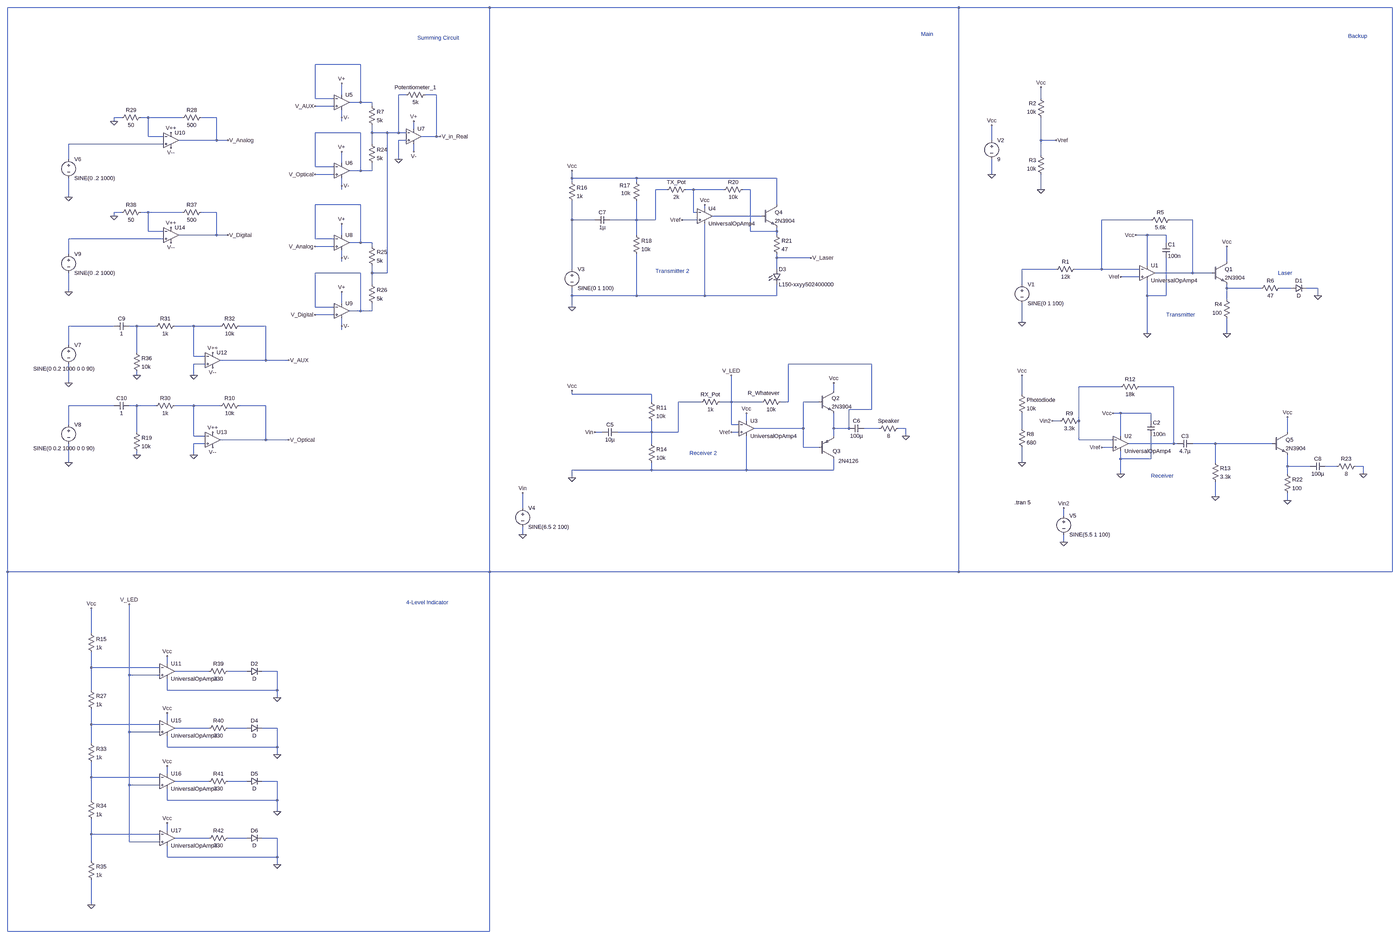
[diagram p0: schematic Draft1.asc, whole sheet]
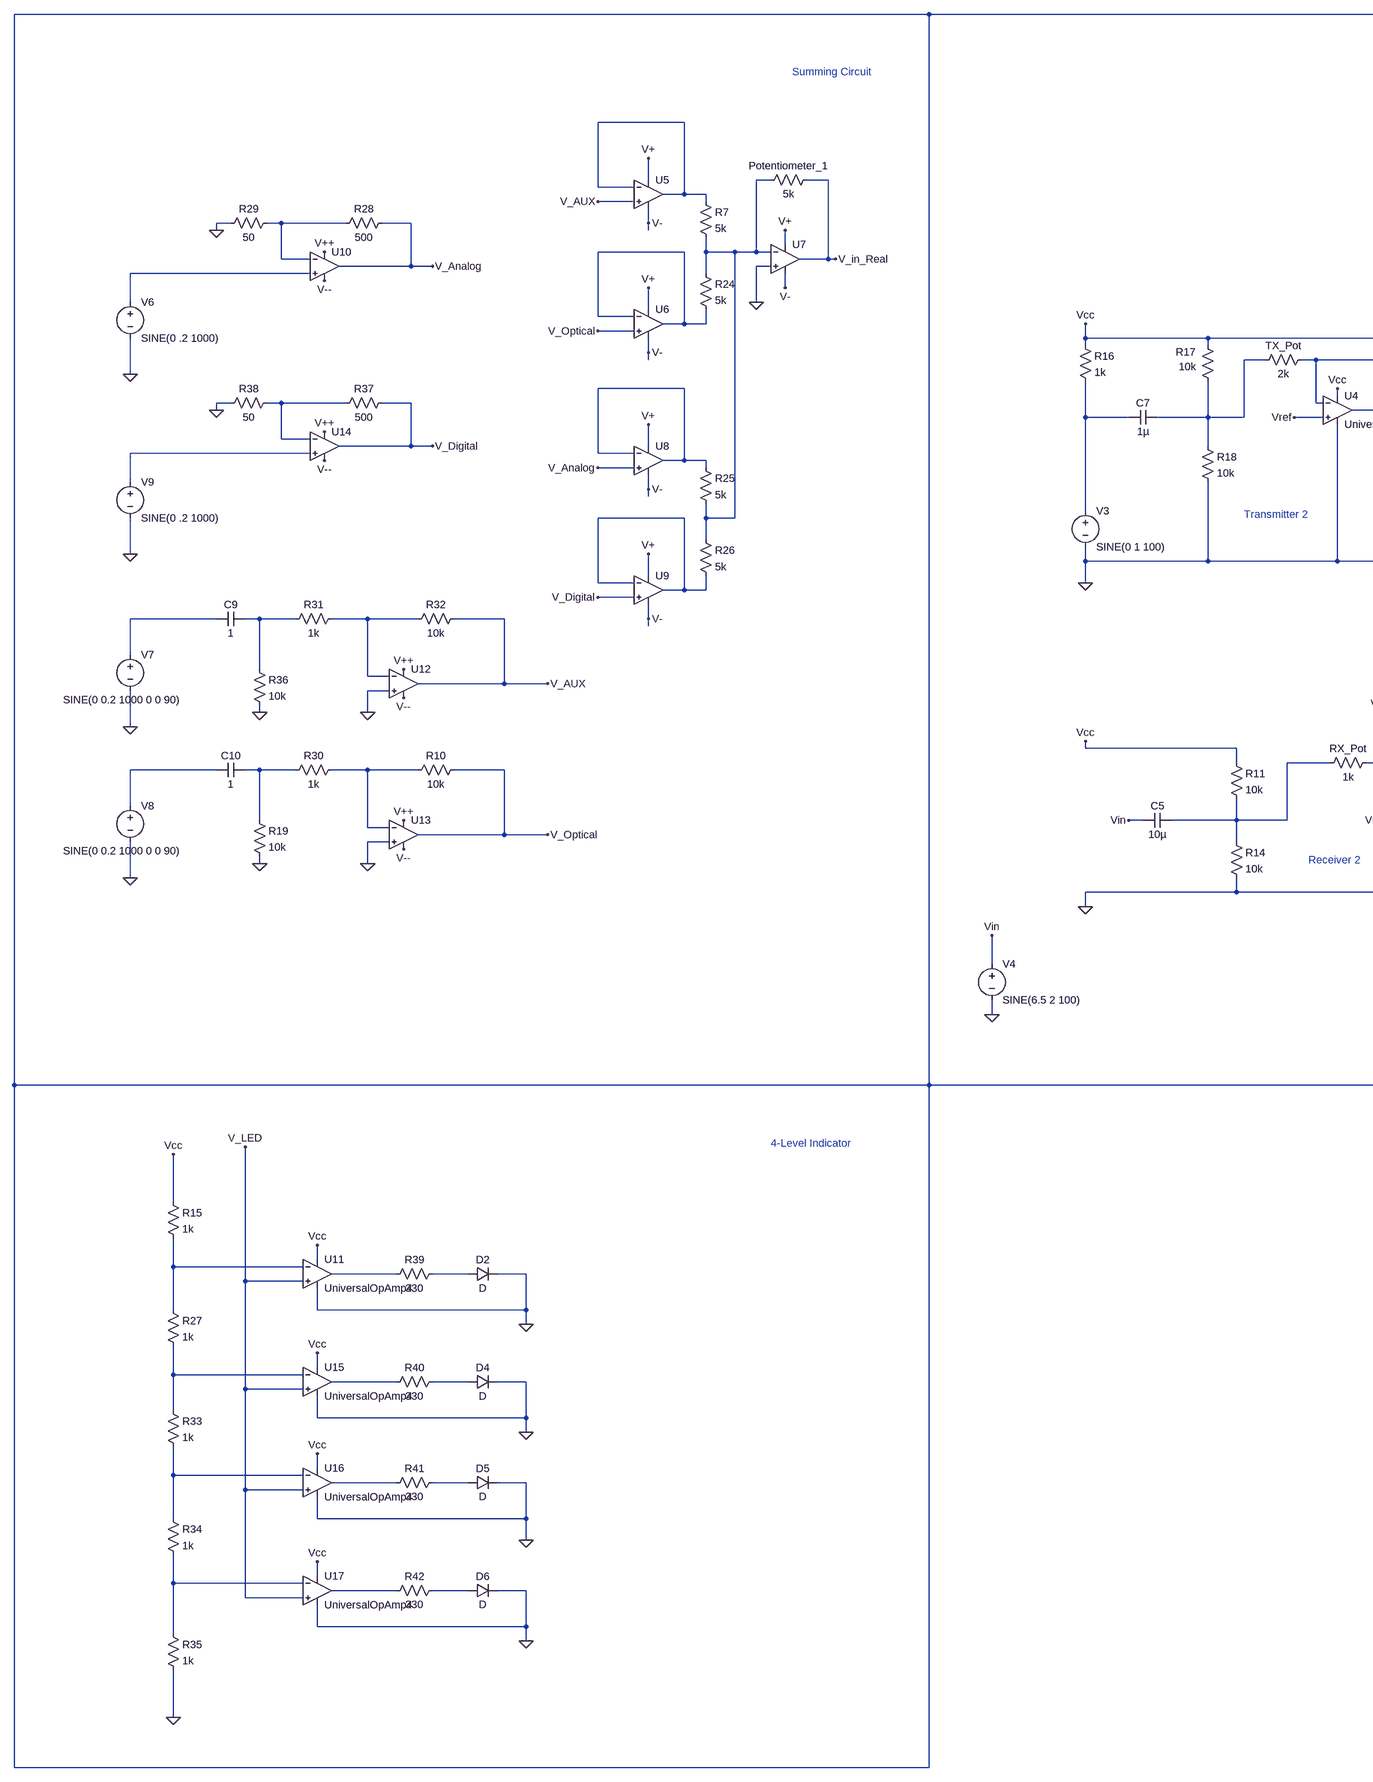
[diagram p1: schematic Draft1.asc, part, row 1 of 1, column 1 of 2]
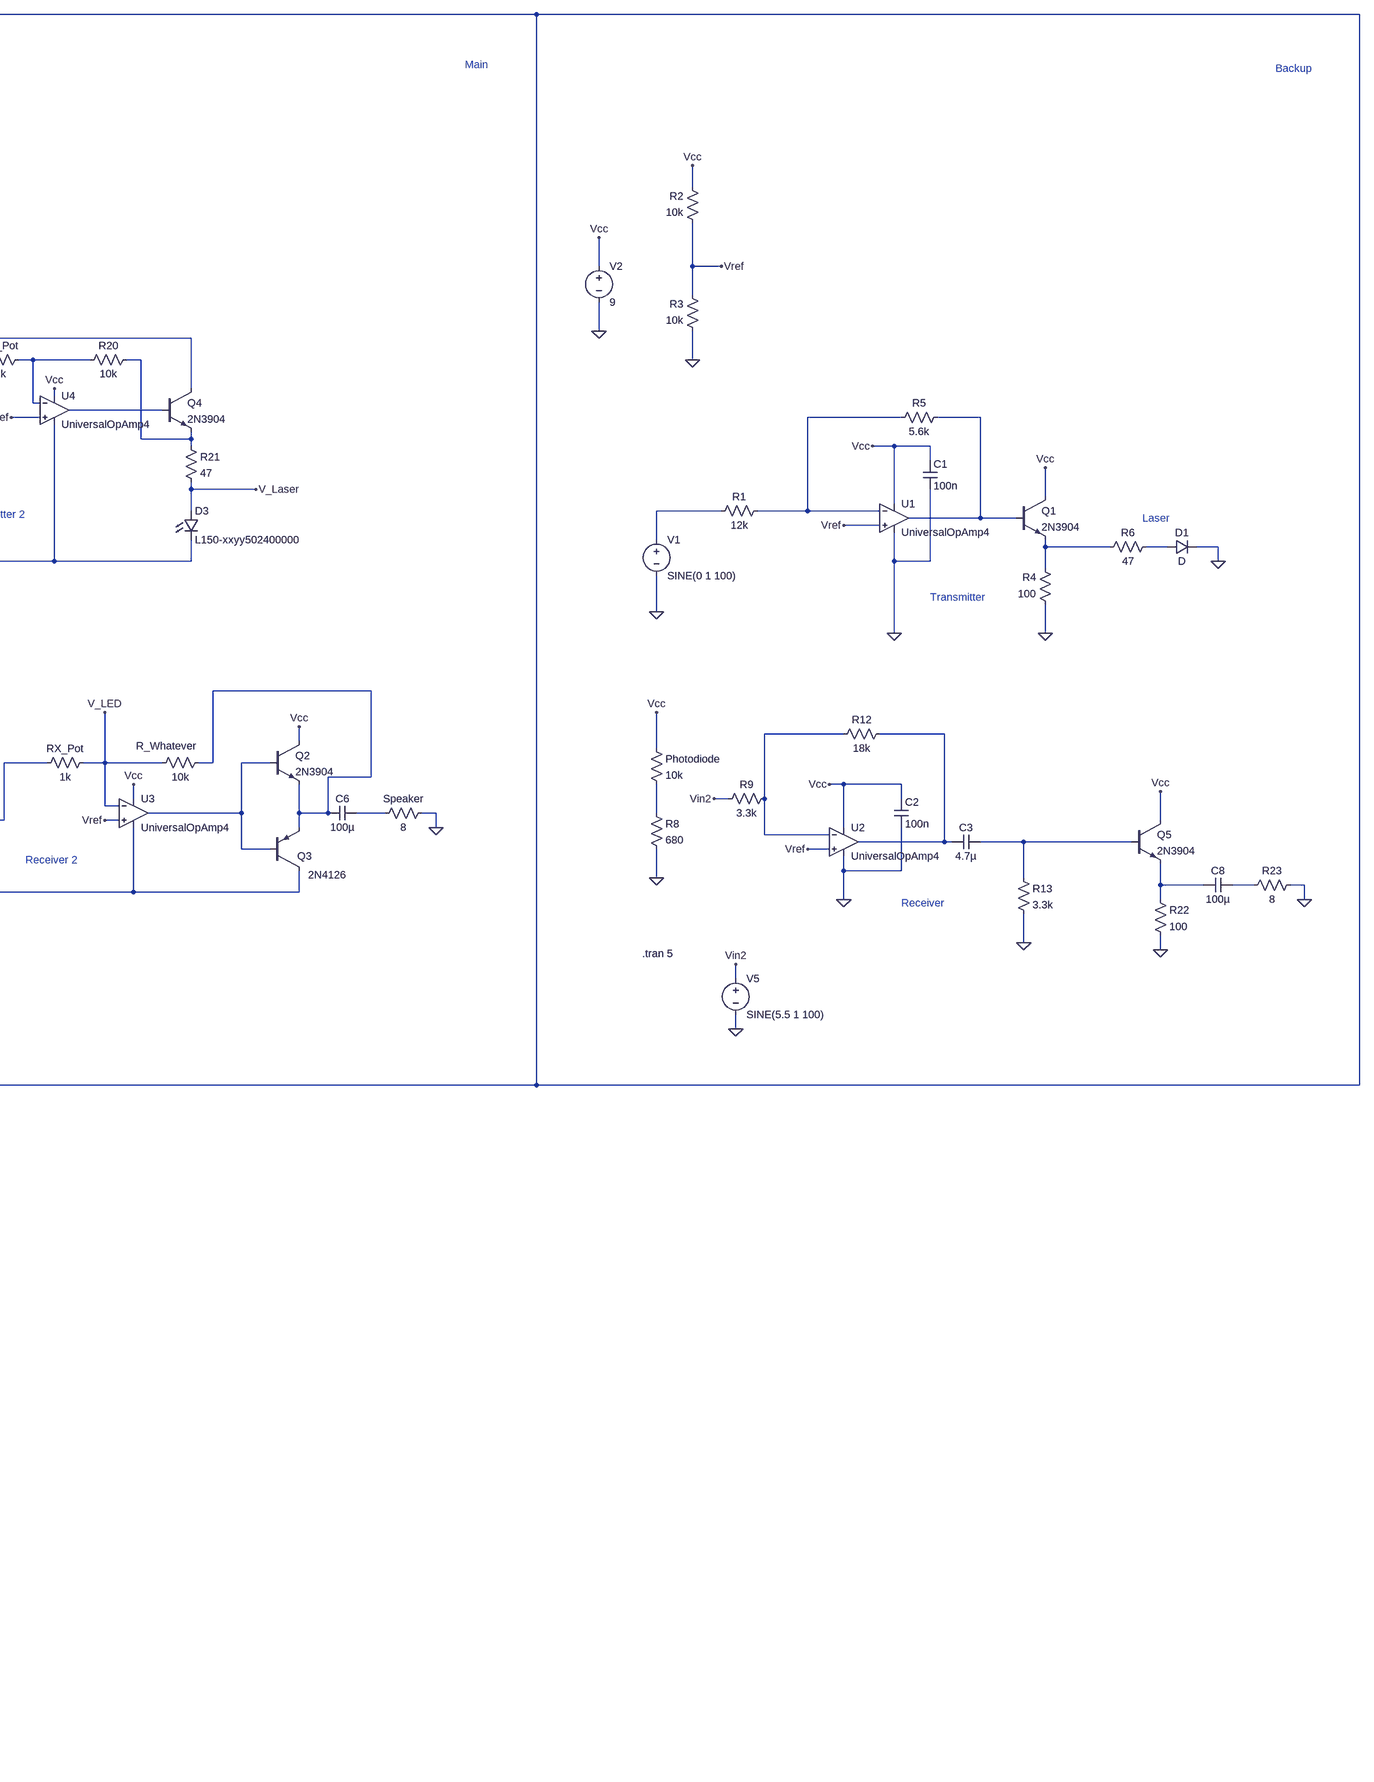
[diagram p2: schematic Draft1.asc, part, row 1 of 1, column 2 of 2]
Draft1.asc, the LTspice schematic file:
Version 4.1
SHEET 1 5492 4292
WIRE 1456 -944 -624 -944
WIRE 3520 -944 1456 -944
WIRE 5488 -944 3520 -944
WIRE 912 -704 720 -704
WIRE 832 -576 832 -624
WIRE 1104 -576 1072 -576
WIRE 1232 -576 1184 -576
WIRE 720 -560 720 -704
WIRE 800 -560 720 -560
WIRE 3952 -560 3952 -608
WIRE 912 -544 912 -704
WIRE 912 -544 864 -544
WIRE 960 -544 912 -544
WIRE 800 -528 720 -528
WIRE 960 -528 960 -544
WIRE -96 -480 -128 -480
WIRE 16 -480 -16 -480
WIRE 160 -480 16 -480
WIRE 304 -480 240 -480
WIRE 832 -480 832 -512
WIRE -128 -464 -128 -480
WIRE 832 -464 832 -480
WIRE 1136 -432 1136 -464
WIRE 912 -416 720 -416
WIRE 960 -416 960 -448
WIRE 1024 -416 960 -416
WIRE 1072 -416 1072 -576
WIRE 1072 -416 1024 -416
WIRE 1104 -416 1072 -416
WIRE 16 -400 16 -480
WIRE 80 -400 16 -400
WIRE 1232 -400 1232 -576
WIRE 1232 -400 1168 -400
WIRE 1248 -400 1232 -400
WIRE 304 -384 304 -480
WIRE 304 -384 144 -384
WIRE 352 -384 304 -384
WIRE 1104 -384 1072 -384
WIRE 3744 -384 3744 -448
WIRE 3952 -384 3952 -480
WIRE 4016 -384 3952 -384
WIRE 80 -368 -320 -368
WIRE 960 -368 960 -416
WIRE 1136 -336 1136 -368
WIRE 3952 -320 3952 -384
WIRE -320 -304 -320 -368
WIRE 1072 -304 1072 -384
WIRE 832 -288 832 -336
WIRE 720 -272 720 -416
WIRE 800 -272 720 -272
WIRE 912 -256 912 -416
WIRE 912 -256 864 -256
WIRE 960 -256 960 -288
WIRE 960 -256 912 -256
WIRE 800 -240 720 -240
WIRE 3744 -240 3744 -304
WIRE 1872 -224 1872 -256
WIRE 2144 -224 1872 -224
WIRE 2736 -224 2144 -224
WIRE 1872 -208 1872 -224
WIRE 2144 -208 2144 -224
WIRE 832 -192 832 -224
WIRE 832 -176 832 -192
WIRE 2272 -176 2224 -176
WIRE 2384 -176 2352 -176
WIRE 2512 -176 2384 -176
WIRE 2624 -176 2592 -176
WIRE 3952 -176 3952 -240
WIRE -320 -144 -320 -224
WIRE 912 -112 720 -112
WIRE 2736 -112 2736 -224
WIRE 2432 -96 2432 -112
WIRE -96 -80 -128 -80
WIRE 16 -80 -16 -80
WIRE 160 -80 16 -80
WIRE 304 -80 240 -80
WIRE 2384 -80 2384 -176
WIRE 2400 -80 2384 -80
WIRE -128 -64 -128 -80
WIRE 2672 -64 2464 -64
WIRE 1872 -48 1872 -128
WIRE 1968 -48 1872 -48
WIRE 2144 -48 2144 -128
WIRE 2144 -48 2032 -48
WIRE 2224 -48 2224 -176
WIRE 2224 -48 2144 -48
WIRE 2400 -48 2336 -48
WIRE 4416 -48 4208 -48
WIRE 4592 -48 4496 -48
WIRE 16 0 16 -80
WIRE 80 0 16 0
WIRE 2624 0 2624 -176
WIRE 2736 0 2736 -16
WIRE 2736 0 2624 0
WIRE 304 16 304 -80
WIRE 304 16 144 16
WIRE 352 16 304 16
WIRE 832 16 832 -32
WIRE 2144 16 2144 -48
WIRE 2736 16 2736 0
WIRE 4400 16 4352 16
WIRE 4480 16 4400 16
WIRE 80 32 -320 32
WIRE 720 32 720 -112
WIRE 800 32 720 32
WIRE 912 48 912 -112
WIRE 912 48 864 48
WIRE 960 48 912 48
WIRE 4480 48 4480 16
WIRE 800 64 720 64
WIRE 960 64 960 48
WIRE -320 96 -320 32
WIRE 832 112 832 80
WIRE 2736 112 2736 96
WIRE 2880 112 2736 112
WIRE 832 128 832 112
WIRE 4736 128 4736 64
WIRE 4400 144 4400 16
WIRE 1872 160 1872 -48
WIRE 2736 160 2736 112
WIRE 4016 160 3872 160
WIRE 4208 160 4208 -48
WIRE 4208 160 4096 160
WIRE 4368 160 4208 160
WIRE 912 176 720 176
WIRE 960 176 960 144
WIRE 1024 176 1024 -416
WIRE 1024 176 960 176
WIRE 4592 176 4592 -48
WIRE 4592 176 4432 176
WIRE 4672 176 4592 176
WIRE 4368 192 4288 192
WIRE 960 224 960 176
WIRE 3872 224 3872 160
WIRE 4736 240 4736 224
WIRE 4880 240 4736 240
WIRE 5008 240 4960 240
WIRE 5120 240 5072 240
WIRE -320 256 -320 176
WIRE 1872 272 1872 240
WIRE 2144 272 2144 96
WIRE 2144 272 1872 272
WIRE 2432 272 2432 -32
WIRE 2432 272 2144 272
WIRE 2736 272 2736 224
WIRE 2736 272 2432 272
WIRE 4400 272 4400 208
WIRE 4480 272 4480 112
WIRE 4480 272 4400 272
WIRE 5120 272 5120 240
WIRE 4736 288 4736 240
WIRE 832 304 832 256
WIRE 720 320 720 176
WIRE 800 320 720 320
WIRE 1872 320 1872 272
WIRE 912 336 912 176
WIRE 912 336 864 336
WIRE 960 336 960 304
WIRE 960 336 912 336
WIRE 800 352 720 352
WIRE 3872 384 3872 304
WIRE -128 400 -320 400
WIRE -32 400 -64 400
WIRE 48 400 -32 400
WIRE 208 400 128 400
WIRE 320 400 208 400
WIRE 512 400 400 400
WIRE 832 400 832 368
WIRE 832 416 832 400
WIRE 4400 432 4400 272
WIRE 4736 432 4736 368
WIRE -320 480 -320 400
WIRE -32 512 -32 400
WIRE 208 528 208 400
WIRE 256 528 208 528
WIRE 512 544 512 400
WIRE 512 544 320 544
WIRE 608 544 512 544
WIRE 256 560 208 560
WIRE 3136 560 2784 560
WIRE -32 608 -32 592
WIRE 208 608 208 560
WIRE -320 640 -320 560
WIRE 4288 656 4112 656
WIRE 4512 656 4368 656
WIRE 2976 672 2976 640
WIRE 1872 688 1872 672
WIRE 2208 688 1872 688
WIRE 3872 688 3872 608
WIRE 2208 720 2208 688
WIRE 2416 720 2320 720
WIRE 2544 720 2544 608
WIRE 2544 720 2496 720
WIRE 2672 720 2544 720
WIRE 2784 720 2784 560
WIRE 2784 720 2752 720
WIRE 2912 720 2848 720
WIRE -128 736 -320 736
WIRE -32 736 -64 736
WIRE 48 736 -32 736
WIRE 208 736 128 736
WIRE 320 736 208 736
WIRE 512 736 400 736
WIRE 3136 752 3136 560
WIRE 3136 752 3040 752
WIRE 4288 768 4256 768
WIRE 4416 768 4288 768
WIRE 2608 800 2608 768
WIRE 4032 800 4000 800
WIRE 4112 800 4112 656
WIRE 4416 800 4416 768
WIRE -320 816 -320 736
WIRE 2544 816 2544 720
WIRE 2576 816 2544 816
WIRE 2848 832 2848 720
WIRE 2848 832 2640 832
WIRE 2976 832 2976 768
WIRE 3040 832 3040 752
WIRE 3040 832 2976 832
WIRE 3168 832 3104 832
WIRE 3280 832 3248 832
WIRE 3872 832 3872 768
WIRE -32 848 -32 736
WIRE 2000 848 1968 848
WIRE 2208 848 2208 800
WIRE 2208 848 2064 848
WIRE 2320 848 2320 720
WIRE 2320 848 2208 848
WIRE 2576 848 2544 848
WIRE 4992 848 4992 784
WIRE 208 864 208 736
WIRE 256 864 208 864
WIRE 2976 864 2976 832
WIRE 3280 864 3280 832
WIRE 4288 864 4288 768
WIRE 512 880 512 736
WIRE 512 880 320 880
WIRE 608 880 512 880
WIRE 4112 880 4112 800
WIRE 4256 880 4112 880
WIRE 256 896 208 896
WIRE 2208 896 2208 848
WIRE 4512 896 4512 656
WIRE 4512 896 4320 896
WIRE 4528 896 4512 896
WIRE 4688 896 4592 896
WIRE 4928 896 4688 896
WIRE 2848 912 2848 832
WIRE 2912 912 2848 912
WIRE 4256 912 4208 912
WIRE -32 944 -32 928
WIRE 208 944 208 896
WIRE 4288 960 4288 928
WIRE 4416 960 4416 864
WIRE 4416 960 4288 960
WIRE -320 976 -320 896
WIRE 3872 976 3872 912
WIRE 4688 976 4688 896
WIRE 4992 992 4992 944
WIRE 5088 992 4992 992
WIRE 5200 992 5152 992
WIRE 5312 992 5280 992
WIRE 2208 1008 2208 976
WIRE 2208 1008 1872 1008
WIRE 2608 1008 2608 864
WIRE 2608 1008 2208 1008
WIRE 2976 1008 2976 960
WIRE 2976 1008 2608 1008
WIRE 4288 1024 4288 960
WIRE 4992 1024 4992 992
WIRE 5312 1024 5312 992
WIRE 1872 1040 1872 1008
WIRE 4688 1120 4688 1056
WIRE 4992 1136 4992 1104
WIRE 1664 1168 1664 1104
WIRE 4048 1200 4048 1168
WIRE 1664 1280 1664 1248
WIRE 4048 1312 4048 1280
WIRE -624 1472 -624 -944
WIRE 1456 1472 1456 -944
WIRE 1456 1472 -624 1472
WIRE 3520 1472 3520 -944
WIRE 3520 1472 1456 1472
WIRE 5488 1472 5488 -944
WIRE 5488 1472 3520 1472
WIRE -224 1760 -224 1632
WIRE 96 1888 96 1856
WIRE -224 1904 -224 1840
WIRE 64 1904 -224 1904
WIRE 272 1920 128 1920
WIRE 432 1920 352 1920
WIRE 560 1920 496 1920
WIRE -64 1936 -64 1616
WIRE 64 1936 -64 1936
WIRE -224 2000 -224 1904
WIRE 96 2000 96 1952
WIRE 560 2000 560 1920
WIRE 560 2000 96 2000
WIRE 560 2032 560 2000
WIRE 96 2128 96 2096
WIRE -224 2144 -224 2080
WIRE 64 2144 -224 2144
WIRE 272 2160 128 2160
WIRE 432 2160 352 2160
WIRE 560 2160 496 2160
WIRE -64 2176 -64 1936
WIRE 64 2176 -64 2176
WIRE -224 2224 -224 2144
WIRE 96 2240 96 2192
WIRE 560 2240 560 2160
WIRE 560 2240 96 2240
WIRE 560 2272 560 2240
WIRE 96 2352 96 2320
WIRE -224 2368 -224 2304
WIRE 64 2368 -224 2368
WIRE 272 2384 128 2384
WIRE 432 2384 352 2384
WIRE 560 2384 496 2384
WIRE -64 2400 -64 2176
WIRE 64 2400 -64 2400
WIRE -224 2464 -224 2368
WIRE 96 2464 96 2416
WIRE 560 2464 560 2384
WIRE 560 2464 96 2464
WIRE 560 2512 560 2464
WIRE 96 2592 96 2560
WIRE -224 2608 -224 2544
WIRE 64 2608 -224 2608
WIRE 272 2624 128 2624
WIRE 432 2624 352 2624
WIRE 560 2624 496 2624
WIRE -64 2640 -64 2400
WIRE 64 2640 -64 2640
WIRE 96 2704 96 2656
WIRE 560 2704 560 2624
WIRE 560 2704 96 2704
WIRE -224 2720 -224 2608
WIRE 560 2736 560 2704
WIRE -224 2976 -224 2800
WIRE -624 3088 -624 1472
WIRE 1456 3088 1456 1472
WIRE 1456 3088 -624 3088
FLAG 3872 384 0
FLAG 4400 432 0
FLAG 4736 432 0
FLAG 5120 272 0
FLAG 4736 64 Vcc
FLAG 3952 -608 Vcc
FLAG 4352 16 Vcc
FLAG 3744 -240 0
FLAG 3744 -448 Vcc
FLAG 3872 976 0
FLAG 4288 1024 0
FLAG 4688 1120 0
FLAG 3872 608 Vcc
FLAG 4256 768 Vcc
FLAG 4016 -384 Vref
FLAG 4288 192 Vref
FLAG 4208 912 Vref
FLAG 3952 -176 0
FLAG 1872 1040 0
FLAG 1872 672 Vcc
FLAG 2608 768 Vcc
FLAG 2976 640 Vcc
FLAG 3280 864 0
FLAG 1872 320 0
FLAG 1872 -256 Vcc
FLAG 2432 -112 Vcc
FLAG 2336 -48 Vref
FLAG 2544 848 Vref
FLAG 4992 784 Vcc
FLAG 4992 1136 0
FLAG 5312 1024 0
FLAG 1664 1280 0
FLAG 1664 1104 Vin
FLAG 1968 848 Vin
FLAG 4048 1168 Vin2
FLAG 4048 1312 0
FLAG 4000 800 Vin2
FLAG 832 -624 V+
FLAG 832 -480 V-
FLAG 832 -336 V+
FLAG 832 -192 V-
FLAG 1248 -400 V_in_Real
FLAG 720 -528 V_AUX
FLAG 720 352 V_Digital
FLAG 1072 -304 0
FLAG 1136 -464 V+
FLAG 1136 -336 V-
FLAG 832 -32 V+
FLAG 832 112 V-
FLAG 832 256 V+
FLAG 832 400 V-
FLAG 720 64 V_Analog
FLAG 720 -240 V_Optical
FLAG -320 -144 0
FLAG -128 -464 0
FLAG 112 -416 V++
FLAG 112 -352 V--
FLAG -320 640 0
FLAG 288 512 V++
FLAG 288 576 V--
FLAG 208 608 0
FLAG -32 608 0
FLAG 2880 112 V_Laser
FLAG 608 544 V_AUX
FLAG -320 976 0
FLAG 288 848 V++
FLAG 288 912 V--
FLAG 208 944 0
FLAG -32 944 0
FLAG 608 880 V_Optical
FLAG -320 256 0
FLAG -128 -64 0
FLAG 112 -16 V++
FLAG 112 48 V--
FLAG 352 16 V_Digital
FLAG 352 -384 V_Analog
FLAG 2544 608 V_LED
FLAG -224 1632 Vcc
FLAG -224 2976 0
FLAG 560 2032 0
FLAG 560 2272 0
FLAG 560 2512 0
FLAG 560 2736 0
FLAG 96 1856 Vcc
FLAG 96 2096 Vcc
FLAG 96 2320 Vcc
FLAG 96 2560 Vcc
FLAG -64 1616 V_LED
SYMBOL voltage 3872 208 R0
WINDOW 123 0 0 Left 0
WINDOW 39 0 0 Left 0
SYMATTR InstName V1
SYMATTR Value SINE(0 1 100)
SYMBOL res 4112 144 R90
WINDOW 0 0 56 VBottom 2
WINDOW 3 32 56 VTop 2
SYMATTR InstName R1
SYMATTR Value 12k
SYMBOL res 3968 -464 R180
WINDOW 0 36 76 Left 2
WINDOW 3 36 40 Left 2
SYMATTR InstName R2
SYMATTR Value 10k
SYMBOL res 3968 -224 R180
WINDOW 0 36 76 Left 2
WINDOW 3 36 40 Left 2
SYMATTR InstName R3
SYMATTR Value 10k
SYMBOL res 4752 384 R180
WINDOW 0 36 76 Left 2
WINDOW 3 36 40 Left 2
SYMATTR InstName R4
SYMATTR Value 100
SYMBOL OpAmps\\UniversalOpAmp4 4400 176 R0
SYMATTR InstName U1
SYMBOL res 4512 -64 R90
WINDOW 0 0 56 VBottom 2
WINDOW 3 32 56 VTop 2
SYMATTR InstName R5
SYMATTR Value 5.6k
SYMBOL res 4976 224 R90
WINDOW 0 0 56 VBottom 2
WINDOW 3 32 56 VTop 2
SYMATTR InstName R6
SYMATTR Value 47
SYMBOL cap 4464 48 R0
SYMATTR InstName C1
SYMATTR Value 100n
SYMBOL diode 5008 256 R270
WINDOW 0 32 32 VTop 2
WINDOW 3 0 32 VBottom 2
SYMATTR InstName D1
SYMBOL npn 4672 128 R0
SYMATTR InstName Q1
SYMATTR Value 2N3904
SYMBOL voltage 3744 -400 R0
WINDOW 123 0 0 Left 0
WINDOW 39 0 0 Left 0
SYMATTR InstName V2
SYMATTR Value 9
SYMBOL res 3856 672 R0
SYMATTR InstName Photodiode
SYMATTR Value 10k
SYMBOL res 3856 816 R0
SYMATTR InstName R8
SYMATTR Value 680
SYMBOL res 4128 784 R90
WINDOW 0 0 56 VBottom 2
WINDOW 3 32 56 VTop 2
SYMATTR InstName R9
SYMATTR Value 3.3k
SYMBOL res 4272 672 R270
WINDOW 0 32 56 VTop 2
WINDOW 3 0 56 VBottom 2
SYMATTR InstName R12
SYMATTR Value 18k
SYMBOL res 4672 960 R0
SYMATTR InstName R13
SYMATTR Value 3.3k
SYMBOL OpAmps\\UniversalOpAmp4 4288 896 R0
SYMATTR InstName U2
SYMBOL cap 4400 800 R0
SYMATTR InstName C2
SYMATTR Value 100n
SYMBOL cap 4592 880 R90
WINDOW 0 0 32 VBottom 2
WINDOW 3 32 32 VTop 2
SYMATTR InstName C3
SYMATTR Value 4.7µ
SYMBOL cap 2064 832 R90
WINDOW 0 0 32 VBottom 2
WINDOW 3 32 32 VTop 2
SYMATTR InstName C5
SYMATTR Value 10µ
SYMBOL res 2192 704 R0
SYMATTR InstName R11
SYMATTR Value 10k
SYMBOL res 2192 880 R0
SYMATTR InstName R14
SYMATTR Value 10k
SYMBOL OpAmps\\UniversalOpAmp4 2608 832 R0
SYMATTR InstName U3
SYMBOL res 2512 704 R90
WINDOW 0 0 56 VBottom 2
WINDOW 3 32 56 VTop 2
SYMATTR InstName RX_Pot
SYMATTR Value 1k
SYMBOL res 2768 704 R90
WINDOW 0 -6 87 VBottom 2
WINDOW 3 32 56 VTop 2
SYMATTR InstName R_Whatever
SYMATTR Value 10k
SYMBOL npn 2912 672 R0
SYMATTR InstName Q2
SYMATTR Value 2N3904
SYMBOL cap 3104 816 R90
WINDOW 0 0 32 VBottom 2
WINDOW 3 32 32 VTop 2
SYMATTR InstName C6
SYMATTR Value 100µ
SYMBOL res 3264 816 R90
WINDOW 0 0 56 VBottom 2
WINDOW 3 32 56 VTop 2
SYMATTR InstName Speaker
SYMATTR Value 8
SYMBOL voltage 1872 144 R0
WINDOW 123 0 0 Left 0
WINDOW 39 0 0 Left 0
SYMATTR InstName V3
SYMATTR Value SINE(0 1 100)
SYMBOL res 1856 -224 R0
SYMATTR InstName R16
SYMATTR Value 1k
SYMBOL cap 2032 -64 R90
WINDOW 0 0 32 VBottom 2
WINDOW 3 32 32 VTop 2
SYMATTR InstName C7
SYMATTR Value 1µ
SYMBOL res 2128 -224 R0
WINDOW 0 -55 31 Left 2
WINDOW 3 -49 63 Left 2
SYMATTR InstName R17
SYMATTR Value 10k
SYMBOL res 2128 0 R0
SYMATTR InstName R18
SYMATTR Value 10k
SYMBOL OpAmps\\UniversalOpAmp4 2432 -64 R0
SYMATTR InstName U4
SYMBOL res 2368 -192 R90
WINDOW 0 0 56 VBottom 2
WINDOW 3 32 56 VTop 2
SYMATTR InstName TX_Pot
SYMATTR Value 2k
SYMBOL res 2608 -192 R90
WINDOW 0 0 56 VBottom 2
WINDOW 3 32 56 VTop 2
SYMATTR InstName R20
SYMATTR Value 10k
SYMBOL npn 2672 -112 R0
SYMATTR InstName Q4
SYMATTR Value 2N3904
SYMBOL LED 2720 160 R0
SYMATTR InstName D3
SYMATTR Value L150-xxyy502400000
SYMATTR Description Diode
SYMATTR Type diode
SYMBOL res 2720 0 R0
SYMATTR InstName R21
SYMATTR Value 47
SYMBOL npn 4928 848 R0
SYMATTR InstName Q5
SYMATTR Value 2N3904
SYMBOL res 4976 1008 R0
SYMATTR InstName R22
SYMATTR Value 100
SYMBOL res 5296 976 R90
WINDOW 0 0 56 VBottom 2
WINDOW 3 32 56 VTop 2
SYMATTR InstName R23
SYMATTR Value 8
SYMBOL cap 5152 976 R90
WINDOW 0 0 32 VBottom 2
WINDOW 3 32 32 VTop 2
SYMATTR InstName C8
SYMATTR Value 100µ
SYMBOL voltage 1664 1152 R0
WINDOW 123 0 0 Left 0
WINDOW 39 0 0 Left 0
SYMATTR InstName V4
SYMATTR Value SINE(6.5 2 100)
SYMBOL pnp 2912 960 M180
WINDOW 0 60 32 Left 2
WINDOW 3 84 -9 Left 2
SYMATTR InstName Q3
SYMATTR Value 2N4126
SYMBOL voltage 4048 1184 R0
WINDOW 123 0 0 Left 0
WINDOW 39 0 0 Left 0
SYMATTR InstName V5
SYMATTR Value SINE(5.5 1 100)
SYMBOL OpAmps\\UniversalOpAmp2 832 -544 R0
SYMATTR InstName U5
SYMBOL OpAmps\\UniversalOpAmp2 832 -256 R0
SYMATTR InstName U6
SYMBOL res 944 -544 R0
SYMATTR InstName R7
SYMATTR Value 5k
SYMBOL res 944 -384 R0
SYMATTR InstName R24
SYMATTR Value 5k
SYMBOL OpAmps\\UniversalOpAmp2 1136 -400 R0
SYMATTR InstName U7
SYMBOL res 1200 -592 R90
WINDOW 0 0 56 VBottom 2
WINDOW 3 32 56 VTop 2
SYMATTR InstName Potentiometer_1
SYMATTR Value 5k
SYMBOL OpAmps\\UniversalOpAmp2 832 48 R0
SYMATTR InstName U8
SYMBOL OpAmps\\UniversalOpAmp2 832 336 R0
SYMATTR InstName U9
SYMBOL res 944 48 R0
SYMATTR InstName R25
SYMATTR Value 5k
SYMBOL res 944 208 R0
SYMATTR InstName R26
SYMATTR Value 5k
SYMBOL voltage -320 -320 R0
WINDOW 123 0 0 Left 0
WINDOW 39 0 0 Left 0
SYMATTR InstName V6
SYMATTR Value SINE(0 .2 1000)
SYMBOL res 256 -496 R90
WINDOW 0 0 56 VBottom 2
WINDOW 3 32 56 VTop 2
SYMATTR InstName R28
SYMATTR Value 500
SYMBOL res 0 -496 R90
WINDOW 0 0 56 VBottom 2
WINDOW 3 32 56 VTop 2
SYMATTR InstName R29
SYMATTR Value 50
SYMBOL voltage -320 464 R0
WINDOW 123 0 0 Left 0
WINDOW 39 0 0 Left 0
WINDOW 3 -149 116 Left 2
SYMATTR Value SINE(0 0.2 1000 0 0 90)
SYMATTR InstName V7
SYMBOL cap -64 384 R90
WINDOW 0 0 32 VBottom 2
WINDOW 3 32 32 VTop 2
SYMATTR InstName C9
SYMATTR Value 1
SYMBOL res 416 384 R90
WINDOW 0 0 56 VBottom 2
WINDOW 3 32 56 VTop 2
SYMATTR InstName R32
SYMATTR Value 10k
SYMBOL OpAmps\\UniversalOpAmp2 112 -384 R0
SYMATTR InstName U10
SYMBOL OpAmps\\UniversalOpAmp2 288 544 R0
SYMATTR InstName U12
SYMBOL res -48 496 R0
SYMATTR InstName R36
SYMATTR Value 10k
SYMBOL res 144 384 R90
WINDOW 0 0 56 VBottom 2
WINDOW 3 32 56 VTop 2
SYMATTR InstName R31
SYMATTR Value 1k
SYMBOL voltage -320 800 R0
WINDOW 123 0 0 Left 0
WINDOW 39 0 0 Left 0
WINDOW 3 -149 116 Left 2
SYMATTR Value SINE(0 0.2 1000 0 0 90)
SYMATTR InstName V8
SYMBOL cap -64 720 R90
WINDOW 0 0 32 VBottom 2
WINDOW 3 32 32 VTop 2
SYMATTR InstName C10
SYMATTR Value 1
SYMBOL res 416 720 R90
WINDOW 0 0 56 VBottom 2
WINDOW 3 32 56 VTop 2
SYMATTR InstName R10
SYMATTR Value 10k
SYMBOL OpAmps\\UniversalOpAmp2 288 880 R0
SYMATTR InstName U13
SYMBOL res -48 832 R0
SYMATTR InstName R19
SYMATTR Value 10k
SYMBOL res 144 720 R90
WINDOW 0 0 56 VBottom 2
WINDOW 3 32 56 VTop 2
SYMATTR InstName R30
SYMATTR Value 1k
SYMBOL voltage -320 80 R0
WINDOW 123 0 0 Left 0
WINDOW 39 0 0 Left 0
SYMATTR InstName V9
SYMATTR Value SINE(0 .2 1000)
SYMBOL res 256 -96 R90
WINDOW 0 0 56 VBottom 2
WINDOW 3 32 56 VTop 2
SYMATTR InstName R37
SYMATTR Value 500
SYMBOL res 0 -96 R90
WINDOW 0 0 56 VBottom 2
WINDOW 3 32 56 VTop 2
SYMATTR InstName R38
SYMATTR Value 50
SYMBOL OpAmps\\UniversalOpAmp2 112 16 R0
SYMATTR InstName U14
SYMBOL res -240 1744 R0
SYMATTR InstName R15
SYMATTR Value 1k
SYMBOL res -240 1984 R0
SYMATTR InstName R27
SYMATTR Value 1k
SYMBOL res -240 2208 R0
SYMATTR InstName R33
SYMATTR Value 1k
SYMBOL res -240 2448 R0
SYMATTR InstName R34
SYMATTR Value 1k
SYMBOL OpAmps\\UniversalOpAmp4 96 1920 R0
SYMATTR InstName U11
SYMBOL OpAmps\\UniversalOpAmp4 96 2160 R0
SYMATTR InstName U15
SYMBOL OpAmps\\UniversalOpAmp4 96 2384 R0
SYMATTR InstName U16
SYMBOL OpAmps\\UniversalOpAmp4 96 2624 R0
SYMATTR InstName U17
SYMBOL res -240 2704 R0
SYMATTR InstName R35
SYMATTR Value 1k
SYMBOL res 368 1904 R90
WINDOW 0 0 56 VBottom 2
WINDOW 3 32 56 VTop 2
SYMATTR InstName R39
SYMATTR Value 330
SYMBOL res 368 2144 R90
WINDOW 0 0 56 VBottom 2
WINDOW 3 32 56 VTop 2
SYMATTR InstName R40
SYMATTR Value 330
SYMBOL res 368 2368 R90
WINDOW 0 0 56 VBottom 2
WINDOW 3 32 56 VTop 2
SYMATTR InstName R41
SYMATTR Value 330
SYMBOL res 368 2608 R90
WINDOW 0 0 56 VBottom 2
WINDOW 3 32 56 VTop 2
SYMATTR InstName R42
SYMATTR Value 330
SYMBOL diode 432 1936 R270
WINDOW 0 32 32 VTop 2
WINDOW 3 0 32 VBottom 2
SYMATTR InstName D2
SYMBOL diode 432 2176 R270
WINDOW 0 32 32 VTop 2
WINDOW 3 0 32 VBottom 2
SYMATTR InstName D4
SYMBOL diode 432 2400 R270
WINDOW 0 32 32 VTop 2
WINDOW 3 0 32 VBottom 2
SYMATTR InstName D5
SYMBOL diode 432 2640 R270
WINDOW 0 32 32 VTop 2
WINDOW 3 0 32 VBottom 2
SYMATTR InstName D6
TEXT 4480 352 Left 2 ;Transmitter
TEXT 4416 1032 Left 2 ;Receiver
TEXT 3840 1144 Left 2 !.tran 5
TEXT 4952 176 Left 2 ;Laser
TEXT 2368 936 Left 2 ;Receiver 2
TEXT 1152 -816 Left 2 ;Summing Circuit
TEXT 3344 -832 Left 2 ;Main
TEXT 2224 168 Left 2 ;Transmitter 2
TEXT 5248 -824 Left 2 ;Backup
TEXT 1104 1608 Left 2 ;4-Level Indicator

The netlist it stands for:
* Draft1.asc
V1 N017 0 SINE(0 1 100)
R1 N014 N017 12k
R2 Vref Vcc 10k
R3 0 Vref 10k
R4 0 N019 100
* U1: UniversalOpAmp4 (symbol OpAmps\UniversalOpAmp4 not available, pins judged from their places): In+=Vref In-=N014 V+=Vcc V-=0 OUT=N015
R5 N015 N014 5.6k
R6 N020 N019 47
C1 Vcc 0 100n
D1 N020 0 D
Q1 Vcc N015 N019 0 2N3904
V2 Vcc 0 9
R§Photodiode Vcc N033 10k
R8 N033 0 680
R9 N025 Vin2 3.3k
R12 N025 N026 18k
R13 N034 0 3.3k
* U2: UniversalOpAmp4 (symbol OpAmps\UniversalOpAmp4 not available, pins judged from their places): In+=Vref In-=N025 V+=Vcc V-=0 OUT=N026
C2 Vcc 0 100n
C3 N034 N026 4.7µ
C5 N027 Vin 10µ
R11 Vcc N027 10k
R14 N027 0 10k
* U3: UniversalOpAmp4 (symbol OpAmps\UniversalOpAmp4 not available, pins judged from their places): In+=Vref In-=V_LED V+=Vcc V-=0 OUT=N028
RX_Pot V_LED N027 1k
R_Whatever N024 V_LED 10k
Q2 Vcc N028 N024 0 2N3904
C6 N032 N024 100µ
R§Speaker 0 N032 8
V3 N013 0 SINE(0 1 100)
R16 Vcc N013 1k
C7 N007 N013 1µ
R17 Vcc N007 10k
R18 N007 0 10k
* U4: UniversalOpAmp4 (symbol OpAmps\UniversalOpAmp4 not available, pins judged from their places): In+=Vref In-=N008 V+=Vcc V-=0 OUT=N012
R§TX_Pot N008 N007 2k
R20 N009 N008 10k
Q4 Vcc N012 N009 0 2N3904
D3 V_Laser 0 L150-xxyy502400000
R21 N009 V_Laser 47
Q5 Vcc N034 N035 0 2N3904
R22 N035 0 100
R23 0 N036 8
C8 N036 N035 100µ
V4 Vin 0 SINE(6.5 2 100)
Q3 0 N028 N024 0 2N4126
V5 Vin2 0 SINE(5.5 1 100)
X§U5 V_AUX N002 V+ V- N002 level2 Avol=1Meg GBW=10Meg Slew=10Meg Ilimit=25m Rail=0 Vos=0 En=0 Enk=0 In=0 Ink=0 Rin=500Meg  ; pins In+ In- V+ V- OUT
X§U6 V_Optical N005 V+ V- N005 level2 Avol=1Meg GBW=10Meg Slew=10Meg Ilimit=25m Rail=0 Vos=0 En=0 Enk=0 In=0 Ink=0 Rin=500Meg  ; pins In+ In- V+ V- OUT
R7 N002 N003 5k
R24 N003 N005 5k
X§U7 0 N003 V+ V- V_in_Real level2 Avol=1Meg GBW=10Meg Slew=10Meg Ilimit=25m Rail=0 Vos=0 En=0 Enk=0 In=0 Ink=0 Rin=500Meg  ; pins In+ In- V+ V- OUT
R§Potentiometer_1 V_in_Real N003 5k
X§U8 V_Analog N010 V+ V- N010 level2 Avol=1Meg GBW=10Meg Slew=10Meg Ilimit=25m Rail=0 Vos=0 En=0 Enk=0 In=0 Ink=0 Rin=500Meg  ; pins In+ In- V+ V- OUT
X§U9 V_Digital N018 V+ V- N018 level2 Avol=1Meg GBW=10Meg Slew=10Meg Ilimit=25m Rail=0 Vos=0 En=0 Enk=0 In=0 Ink=0 Rin=500Meg  ; pins In+ In- V+ V- OUT
R25 N010 N003 5k
R26 N003 N018 5k
V6 N006 0 SINE(0 .2 1000)
R28 V_Analog N004 500
R29 N004 0 50
V7 N021 0 SINE(0 0.2 1000 0 0 90)
C9 N022 N021 1
R32 V_AUX N023 10k
X§U10 N006 N004 V++ V-- V_Analog level2 Avol=1Meg GBW=10Meg Slew=10Meg Ilimit=25m Rail=0 Vos=0 En=0 Enk=0 In=0 Ink=0 Rin=500Meg  ; pins In+ In- V+ V- OUT
X§U12 0 N023 V++ V-- V_AUX level2 Avol=1Meg GBW=10Meg Slew=10Meg Ilimit=25m Rail=0 Vos=0 En=0 Enk=0 In=0 Ink=0 Rin=500Meg  ; pins In+ In- V+ V- OUT
R36 N022 0 10k
R31 N023 N022 1k
V8 N029 0 SINE(0 0.2 1000 0 0 90)
C10 N030 N029 1
R10 V_Optical N031 10k
X§U13 0 N031 V++ V-- V_Optical level2 Avol=1Meg GBW=10Meg Slew=10Meg Ilimit=25m Rail=0 Vos=0 En=0 Enk=0 In=0 Ink=0 Rin=500Meg  ; pins In+ In- V+ V- OUT
R19 N030 0 10k
R30 N031 N030 1k
V9 N016 0 SINE(0 .2 1000)
R37 V_Digital N011 500
R38 N011 0 50
X§U14 N016 N011 V++ V-- V_Digital level2 Avol=1Meg GBW=10Meg Slew=10Meg Ilimit=25m Rail=0 Vos=0 En=0 Enk=0 In=0 Ink=0 Rin=500Meg  ; pins In+ In- V+ V- OUT
R15 Vcc N037 1k
R27 N037 N040 1k
R33 N040 N043 1k
R34 N043 N046 1k
* U11: UniversalOpAmp4 (symbol OpAmps\UniversalOpAmp4 not available, pins judged from their places): In+=V_LED In-=N037 V+=Vcc V-=0 OUT=N038
* U15: UniversalOpAmp4 (symbol OpAmps\UniversalOpAmp4 not available, pins judged from their places): In+=V_LED In-=N040 V+=Vcc V-=0 OUT=N041
* U16: UniversalOpAmp4 (symbol OpAmps\UniversalOpAmp4 not available, pins judged from their places): In+=V_LED In-=N043 V+=Vcc V-=0 OUT=N044
* U17: UniversalOpAmp4 (symbol OpAmps\UniversalOpAmp4 not available, pins judged from their places): In+=V_LED In-=N046 V+=Vcc V-=0 OUT=N047
R35 N046 0 1k
R39 N039 N038 330
R40 N042 N041 330
R41 N045 N044 330
R42 N048 N047 330
D2 N039 0 D
D4 N042 0 D
D5 N045 0 D
D6 N048 0 D
.model D D
.lib standard.dio
.model NPN NPN
.model PNP PNP
.lib standard.bjt
* Transmitter
* Receiver
.tran 5
* Laser
* Receiver 2
* Summing Circuit
* Main
* Transmitter 2
* Backup
* 4-Level Indicator
.lib UniversalOpAmp2.lib
.backanno
.end